# Altium schematic sheet JTAG&Trace.SchDoc: JTAG&Trace
size A3; DocumentNumber: MB1144; Revision: C-02; SheetNumber: 24; SheetTotal: 25; Project: STM32L476G-EVAL; ModifiedDate: 9/23/2015
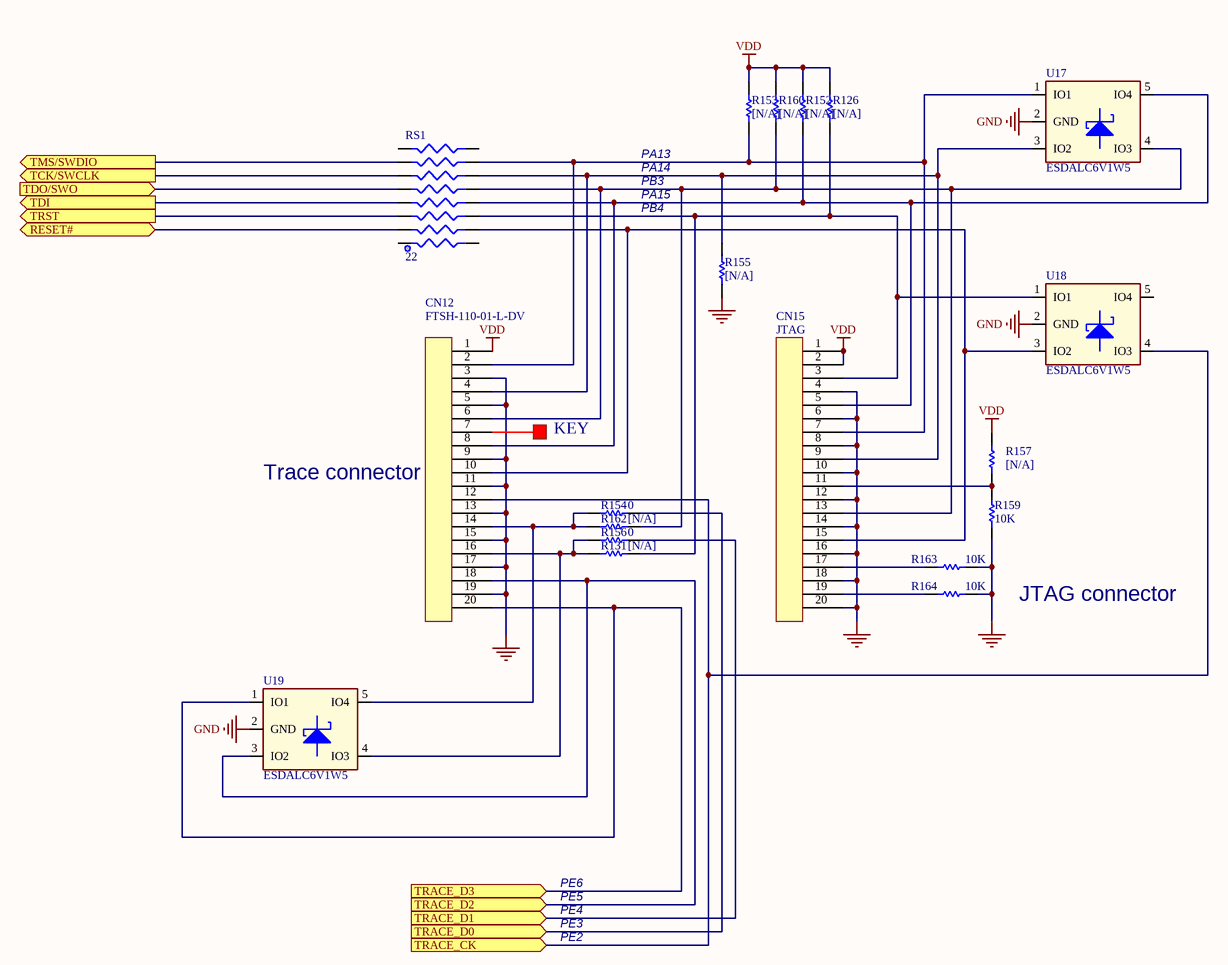
[diagram p0: JTAG&Trace.SchDoc]

## Parts
CN12  FTSH-110-01-L-DV  [FTSH-110-01-L-DV]
CN15  JTAG  [IDC20S]
R126  [N/A]  [0603R]
R131  [N/A]  [0603R]
R152  [N/A]  [0603R]
R153  [N/A]  [0603R]
R154  0  [0603R]
R155  [N/A]  [0603R]
R156  0  [0603R]
R157  [N/A]  [0603R]
R159  10K  [0402R]
R160  [N/A]  [0603R]
R162  [N/A]  [0603R]
R163  10K  [0402R]
R164  10K  [0402R]
RS1  22  [RP0402X8_REV]
U17  ESDALC6V1W5  [SOT-353]
U18  ESDALC6V1W5  [SOT-353]
U19  ESDALC6V1W5  [SOT-353]

## Ports
RESET# (bidir), TCK/SWCLK (out), TDI (out), TDO/SWO (in), TMS/SWDIO (out), TRACE_CK (in), TRACE_D0 (in), TRACE_D1 (in), TRACE_D2 (in), TRACE_D3 (in), TRST (out)

## Nets
GND: CN12.3 CN12.5 CN12.9 CN12.11 CN12.13 CN12.15 CN12.17 CN12.19 CN15.4 CN15.6 CN15.8 CN15.10 CN15.12 CN15.14 CN15.16 CN15.18 CN15.20 R155.1 R159.1 R163.1 R164.1 U17.2(GND) U18.2(GND) U19.2(GND)
VDD: CN12.1 CN15.1 CN15.2 R126.2 R152.2 R153.2 R157.2 R160.2
RESET#: RS1.3 ; port RESET#
TCK/SWCLK: RS1.11 ; port TCK/SWCLK
TDI: RS1.7 ; port TDI
TDO/SWO: RS1.9 ; port TDO/SWO
TMS/SWDIO: RS1.13 ; port TMS/SWDIO
TRACE_CK: CN12.12 U18.4(IO3) ; port TRACE_CK
TRACE_D0: R154.2 ; port TRACE_D0
TRACE_D1: R156.2 ; port TRACE_D1
TRACE_D2: CN12.18 U19.3(IO2) ; port TRACE_D2
TRACE_D3: CN12.20 U19.1(IO1) ; port TRACE_D3
TRST: RS1.5 ; port TRST
NetCN12_2: CN12.2 CN15.7 R153.1 RS1.14 U17.1(IO1)
NetCN12_4: CN12.4 CN15.9 R155.2 RS1.12 U17.3(IO2)
NetCN12_6: CN12.6 CN15.13 R160.1 R162.2 RS1.10 U17.4(IO3)
NetCN12_8: CN12.8 CN15.5 R152.1 RS1.8 U17.5(IO4)
NetCN12_10: CN12.10 CN15.15 RS1.4 U18.3(IO2)
NetCN12_14: CN12.14 R154.1 R162.1 U19.5(IO4)
NetCN12_16: CN12.16 R131.1 R156.1 U19.4(IO3)
NetCN15_3: CN15.3 R126.1 R131.2 RS1.6 U18.1(IO1)
NetCN15_11: CN15.11 R157.1 R159.2
NetCN15_17: CN15.17 R163.2
NetCN15_19: CN15.19 R164.2

Not connected (* = marked no-connect by the designer): CN12 7; RS1 1 2 15 16; U18 5(IO4)

## Notes on the sheet
- PA13
- PA14
- PB3
- PA15
- PB4
- (near CN12) Trace connector
- KEY
- JTAG connector
- PE6
- PE5
- PE4
- PE3
- PE2
- Title:
- Project:
- Size:
- Date:
- A3
- Reference:
- Sheet:
- Revision:
- of

## Library data of the parts
CN12 = 20PIN1: Ordered by: Subcon; Comments: Trace connector; Assembly: with pin7 removed; ECCN_US/EU: NA; Samtec components: FTSH-110-01-L-DV
CN15 = 20PIN1: Ordered by: Subcon; Comments: JTAG connector; ECCN_US/EU: NA
R126 R131 R152 R153 R155 R157 R160 R162 = Res1: Resistor; Value: 1K; Ordered by: Subcon; ECCN_US/EU: NA; Fitted: NO; Published: 8-Jun-2000; Revision: July-2002: Re-released for DXP Platform.; Publisher: Altium Limited
R154 R156 R159 R163 R164 = Res1: Resistor; Value: 1K; Ordered by: Subcon; ECCN_US/EU: NA; Published: 8-Jun-2000; Revision: July-2002: Re-released for DXP Platform.; Publisher: Altium Limited
RS1 = RES8B: Ordered by: Subcon; ECCN_US/EU: NA
U17-U19 = ESDALC6V1W5: Dual Transil array for ESD protection; Manuf_1: ST; Ref St: 9151112; Order: ESDA5V3L; ECCN_US/EU: EAR99/NEC; Manuf_Part_1: ESDALC6V1W5; Distrib: ST; Provided: ST; Ordered by: ST